# Altium schematic sheet Backpanel_GigIO.SchDoc
size A4; Organization: UltraZohm; SheetNumber: 39
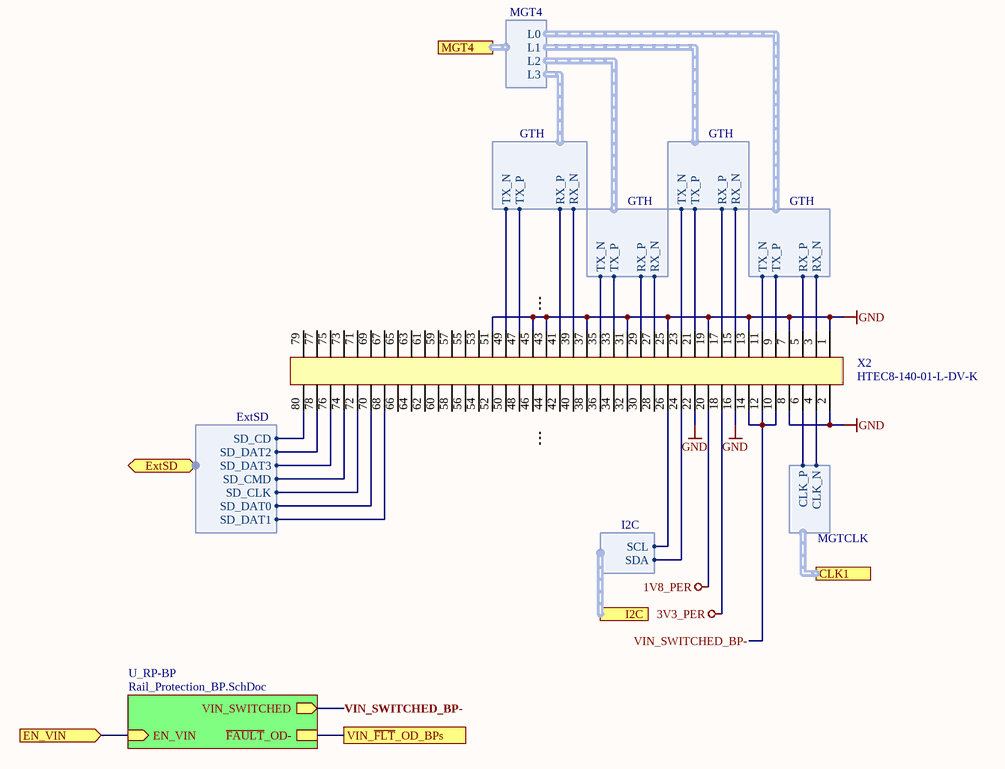
[diagram p0: Backpanel_GigIO.SchDoc]

## Parts
X2  HTEC8-140-01-L-DV-K  [HTEC8-140-XX-X-DV]

## Sub-sheets
U_RP-BP = Rail_Protection_BP.SchDoc: EN_VIN (in), VIN_SWITCHED (out), ~{FAULT}_OD-

## Ports
CLK1 (harness MGTCLK), EN_VIN (in), ExtSD (bidir, harness ExtSD), I2C (harness I2C), MGT4 (harness MGT4), VIN_~{FLT}_OD_BPs

## Harnesses
I2C: SCL, SDA
MGT4: L0, L1, L2, L3
MGTCLK: CLK_N, CLK_P
GTH: RX_N, RX_P, TX_N, TX_P
ExtSD: SD_DAT0, SD_DAT1, SD_DAT2, SD_DAT3, SD_CMD, SD_CLK, SD_CD

## Nets
1V8_PER: X2.20
3V3_PER: X2.18
GND: X2.1 X2.2 X2.7 X2.8 X2.13 X2.16 X2.19 X2.22 X2.25 X2.31 X2.37 X2.43 X2.45 X2.51
EN_VIN: port EN_VIN, sheet U_RP-BP/EN_VIN
VIN_~{FLT}_OD_BPs: port VIN_~{FLT}_OD_BPs, sheet U_RP-BP/~{FAULT}_OD-
VIN_SWITCHED_BP-: X2.10 X2.12 X2.14 ; sheet U_RP-BP/VIN_SWITCHED
NetX2_3: X2.3 ; harness GTH.RX_N
NetX2_4: X2.4 ; port CLK1.CLK_N
NetX2_5: X2.5 ; harness GTH.RX_P
NetX2_6: X2.6 ; port CLK1.CLK_P
NetX2_9: X2.9 ; harness GTH.TX_P
NetX2_11: X2.11 ; harness GTH.TX_N
NetX2_15: X2.15 ; harness GTH.RX_N
NetX2_17: X2.17 ; harness GTH.RX_P
NetX2_21: X2.21 ; harness GTH.TX_P
NetX2_23: X2.23 ; harness GTH.TX_N
NetX2_24: X2.24 ; port I2C.SDA
NetX2_26: X2.26 ; port I2C.SCL
NetX2_27: X2.27 ; harness GTH.RX_N
NetX2_29: X2.29 ; harness GTH.RX_P
NetX2_33: X2.33 ; harness GTH.TX_P
NetX2_35: X2.35 ; harness GTH.TX_N
NetX2_39: X2.39 ; harness GTH.RX_N
NetX2_41: X2.41 ; harness GTH.RX_P
NetX2_47: X2.47 ; harness GTH.TX_P
NetX2_49: X2.49 ; harness GTH.TX_N
NetX2_68: X2.68 ; port ExtSD.SD_DAT1
NetX2_70: X2.70 ; port ExtSD.SD_DAT0
NetX2_72: X2.72 ; port ExtSD.SD_CLK
NetX2_74: X2.74 ; port ExtSD.SD_CMD
NetX2_76: X2.76 ; port ExtSD.SD_DAT3
NetX2_78: X2.78 ; port ExtSD.SD_DAT2
NetX2_80: X2.80 ; port ExtSD.SD_CD

Not connected (* = marked no-connect by the designer): X2 28 30 32 34 36 38 40 42 44 46 48 50 52 53 54 55 56 57 58 59 60 61 62 63 64 65 66 67 69 71 73 75 77 79

## Notes on the sheet
- Title
- Revision:
- Design Engineer:
- Date:
- Project:
- Sheet
- of

## Library data of the parts
X2 = HTEC8-140-01-L-DV-K: Headers & Wire Housings 0.80 mm Rugged High-Speed Edge Card Connectors; Manufacturer: SAMTEC; Created from: AGeiger; Number of positions: 80; Manufacturer Part Number: HTEC8-140-01-L-DV-K; PartID: 23; Created On: 07/06/2024 14:27:34; ComponentLink1Description: Datasheet; ComponentLink1URL: https://suddendocs.samtec.com/catalog_english/htec8.pdf; Component Type: Board to Board Connector; Device Package: SMD; Last Updated: 09/07/2024 10:19:13; Mounting Type: SMD; Series: HTEC8; Supplier 1: SAMTEC; Supplier Part Number 1: HTEC8-140-01-L-DV-K; Type: Board to Board Connector; Live Cycle Status: 1; LCSC Part Number: C20365608; Stock number: not stored; Number of rows: 2